# EAGLE design isp_02 (EAGLE 6.3)
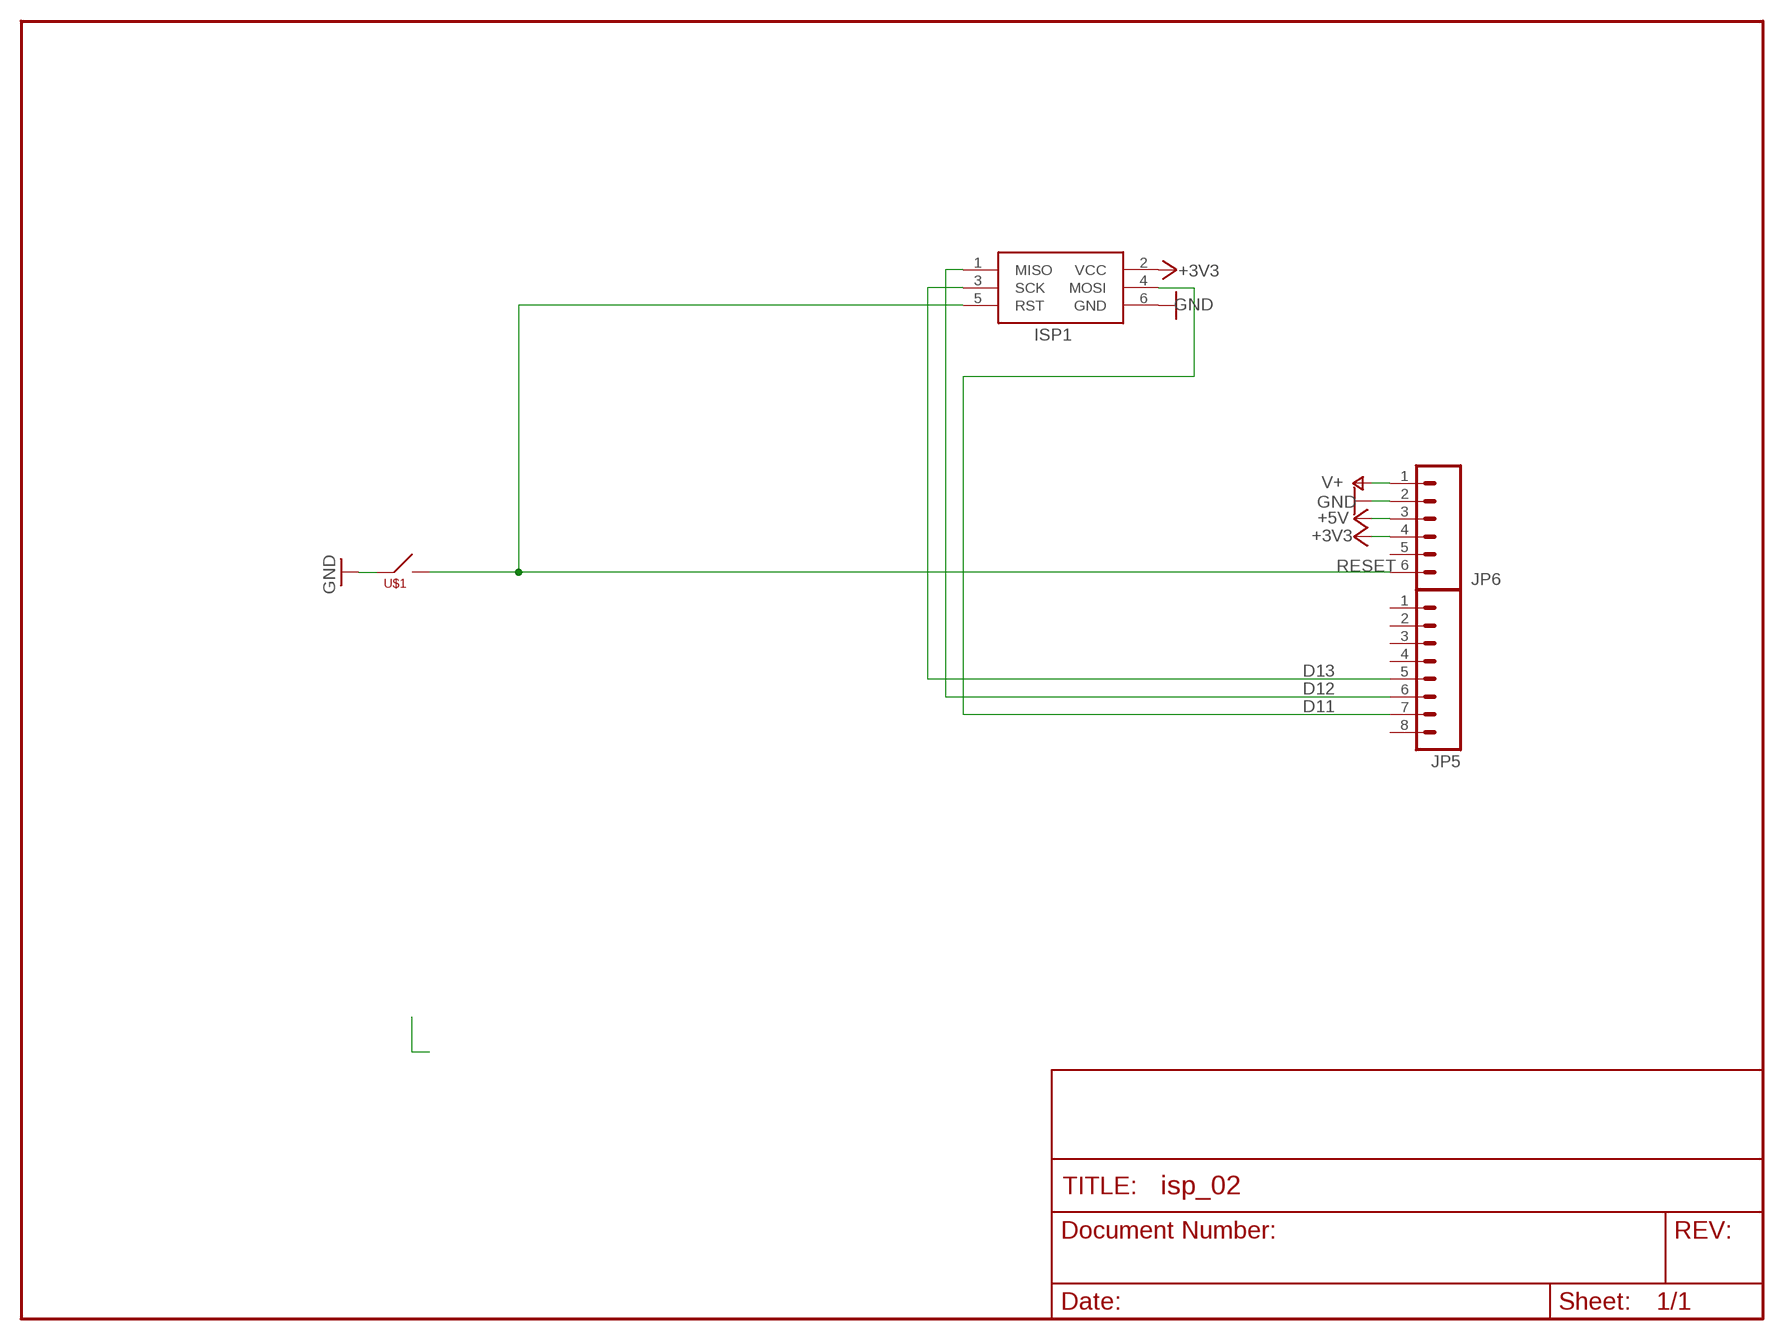
[diagram p0: schematic, sheet 1]

## Parts
ISP1  AVRISP-6  [AVRISP]
JP5  M081X08  [1X08]
JP6  M06SIP  [1X06]
U$1  PTS635_SWITCH  [PTS635_SWITCH]

## Nets
+3V3: ISP1.2(VCC) JP6.4
+5V: JP6.3
D11: ISP1.4(MOSI) JP5.7
D12: ISP1.1(MISO) JP5.6
D13: ISP1.3(SCK) JP5.5
GND: ISP1.6(GND) JP6.2 U$1.P$1
RESET: ISP1.5(RST) JP6.6 U$1.P$2
V+: JP6.1
Unconnected: JP5.1 JP5.2 JP5.3 JP5.4 JP5.8 JP6.5

## Library data of the parts
ISP1 = adafruit:AVRISP: AVR ISP HEADER Standard 6 pin header for AVR programming
JP5 = SparkFun_mod:M08: Header 8 Standard 8-pin 0.1" header. Use with straight break away headers (SKU : PRT-00116), right angle break away headers (PRT-00553), swiss pins (PRT-00743), machine pins (PRT-00117), and female headers (PRT-00115).
JP6 = SparkFun:M06: Header 6 Standard 6-pin 0.1" header. Use with straight break away headers (SKU : PRT-00116), right angle break away headers (PRT-00553), swiss pins (PRT-00743), machine pins (PRT-00117), and female headers (PRT-00115). Molex polarized connector foot print use with SKU : PRT-08094 with associated crimp pins and housings. NOTES ON THE VARIANTS LOCK and LOCK_LONGPADS... This footprint was designed to help hold the alignment of a through-hole component (i.e. 6-pin header) while soldering it into place. You may notice that each hole has been shifted either up or down by 0.005 of an inch from it's more standard position (which is a perfectly straight line). This slight alteration caused the pins (the squares in the middle) to touch the edges of the holes. Because they are alternating, it causes a "brace" to hold the component in place. 0.005 has proven to be the perfect amount of "off-center" position when using our standard breakaway headers. Although looks a little odd when you look at the bare footprint, once you have a header in there, the alteration is very hard to notice. Also, if you push a header all the way into place, it is covered up entirely on the bottom side. This idea of altering the position of holes to aid alignment will be further integrated into the Sparkfun Library for other footprints. It can help hold any component with 3 or more connection pins.
U$1 = _my-parts:PTS635_SWITCH: www.ck-components.com

## Net classes
0 default: width 0.203 mm
1 vcc: width 0.254 mm

## Board
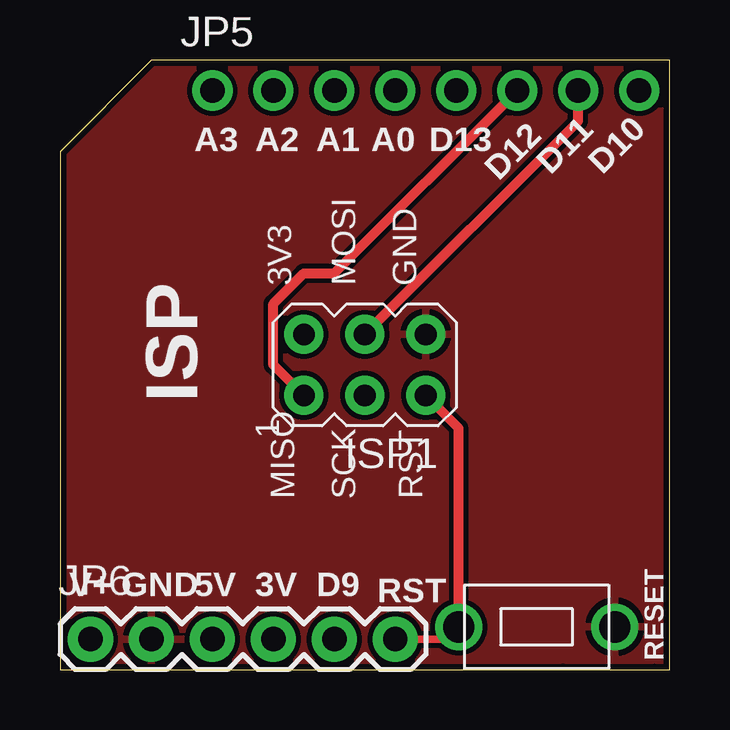
[diagram p1: board, top side]
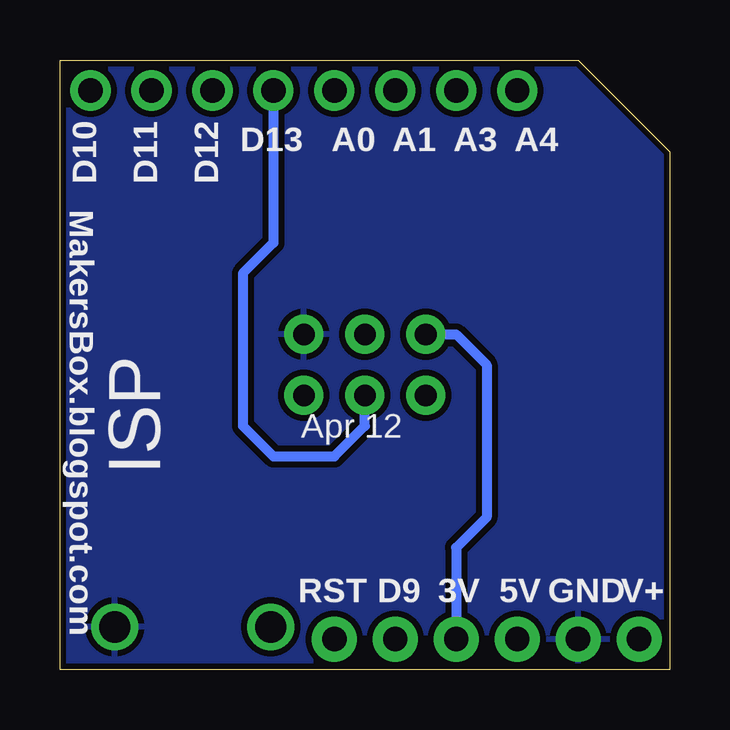
[diagram p2: board, bottom side, seen from below]

Size 25.4 x 25.4 mm. Coordinates in mm from the lower left corner, seen from the top.
Outline: 25.4,25.4 25.4,21.59 25.4,0 24.77,0 20.96,0 0,0 0,21.59
Outline: 25.4,25.4 3.81,25.4 0,21.59
Outline: 0,21.59 0,21.59
Copper layers (1*16): Top 0.035mm / dielectric 1.5mm / Bottom 0.035mm
Design rules "SparkFun": minimum track width 8mil, minimum drill 20mil, track to track 8mil, track to pad 8mil, pad to pad 8mil, via to via 8mil, smd to smd 8mil, copper to edge 10mil, drill to drill 8mil, minimum pad ring 12mil, minimum via ring 10mil, stop-mask expansion 4mil, vias tented up to drill 25mil, thermal gap 10mil

### Footprints (pad centres in the part's own frame; a part is rotated, then mirrored left to right if it is on the bottom)
AVRISP = drill 0.9 pad 1.626: 1 -1.27,2.54; 2 1.27,2.54; 3 -1.27,0; 4 1.27,0; 5 -1.27,-2.54; 6 1.27,-2.54
1X08 = drill 1.016 pad 1.676: 1 0,0; 2 2.54,0; 3 5.08,0; 4 7.62,0; 5 10.16,0; 6 12.7,0; 7 15.24,0; 8 17.78,0
1X06 = drill 1.016 pad 1.88: 1 0,0; 2 2.54,0; 3 5.08,0; 4 7.62,0; 5 10.16,0; 6 12.7,0
PTS635_SWITCH = drill 1.3: P$1 0,0; P$2 6.5,0

### Placement (x,y rotation side)
ISP1  12.7,12.7 90 top
JP5  6.35,24.13 0 top
JP6  1.27,1.27 0 top
U$1  23.11,1.78 180 top

### Tracks (layer width: path | path; a pad name or v marks a point on that pad's centre or on a via)
+3V3
  Bottom 0.406: ISP1.2 8.89,13.97 7.62,12.7 7.62,6.35 8.89,5.08 JP6.4
D11
  Top 0.406: ISP1.4 21.59,22.86 JP5.7
D12
  Top 0.406: ISP1.1 8.89,12.7 8.89,15.24 10.16,16.51 11.43,16.51 JP5.6
D13
  Bottom 0.406: JP5.5 16.51,17.78 17.78,16.51 17.78,10.16 16.51,8.89 13.97,8.89 12.7,10.16 ISP1.3
GND
  pour Bottom (isolate 0.254): -1.27,26.67 26.67,26.67 26.67,-1.27 -1.27,-1.27
  pour Top: -0.64,26.04 26.67,26.04 26.67,0 26.04,-0.64 -0.64,-0.64
RESET
  Top 0.305: JP6.6 16.11,1.27 U$1.P$2
  Top 0.406: U$1.P$2 16.61,10.06 ISP1.5

### Text on the board
tPlace: A3 | A2 | A1 | A0 | D13 | D11 | D10 | D12 | ISP | 3V3 | MOSI | GND | MISO | SCK | RST | V+ | GND | 5V | 3V | D9 | RST | RESET
bPlace: D12 | D11 | D10 | A4 | A3 | A1 | A0 | D13 | MakersBox.blogspot.com | Apr 12 | ISP | V+ | GND | 5V | 3V | D9 | RST